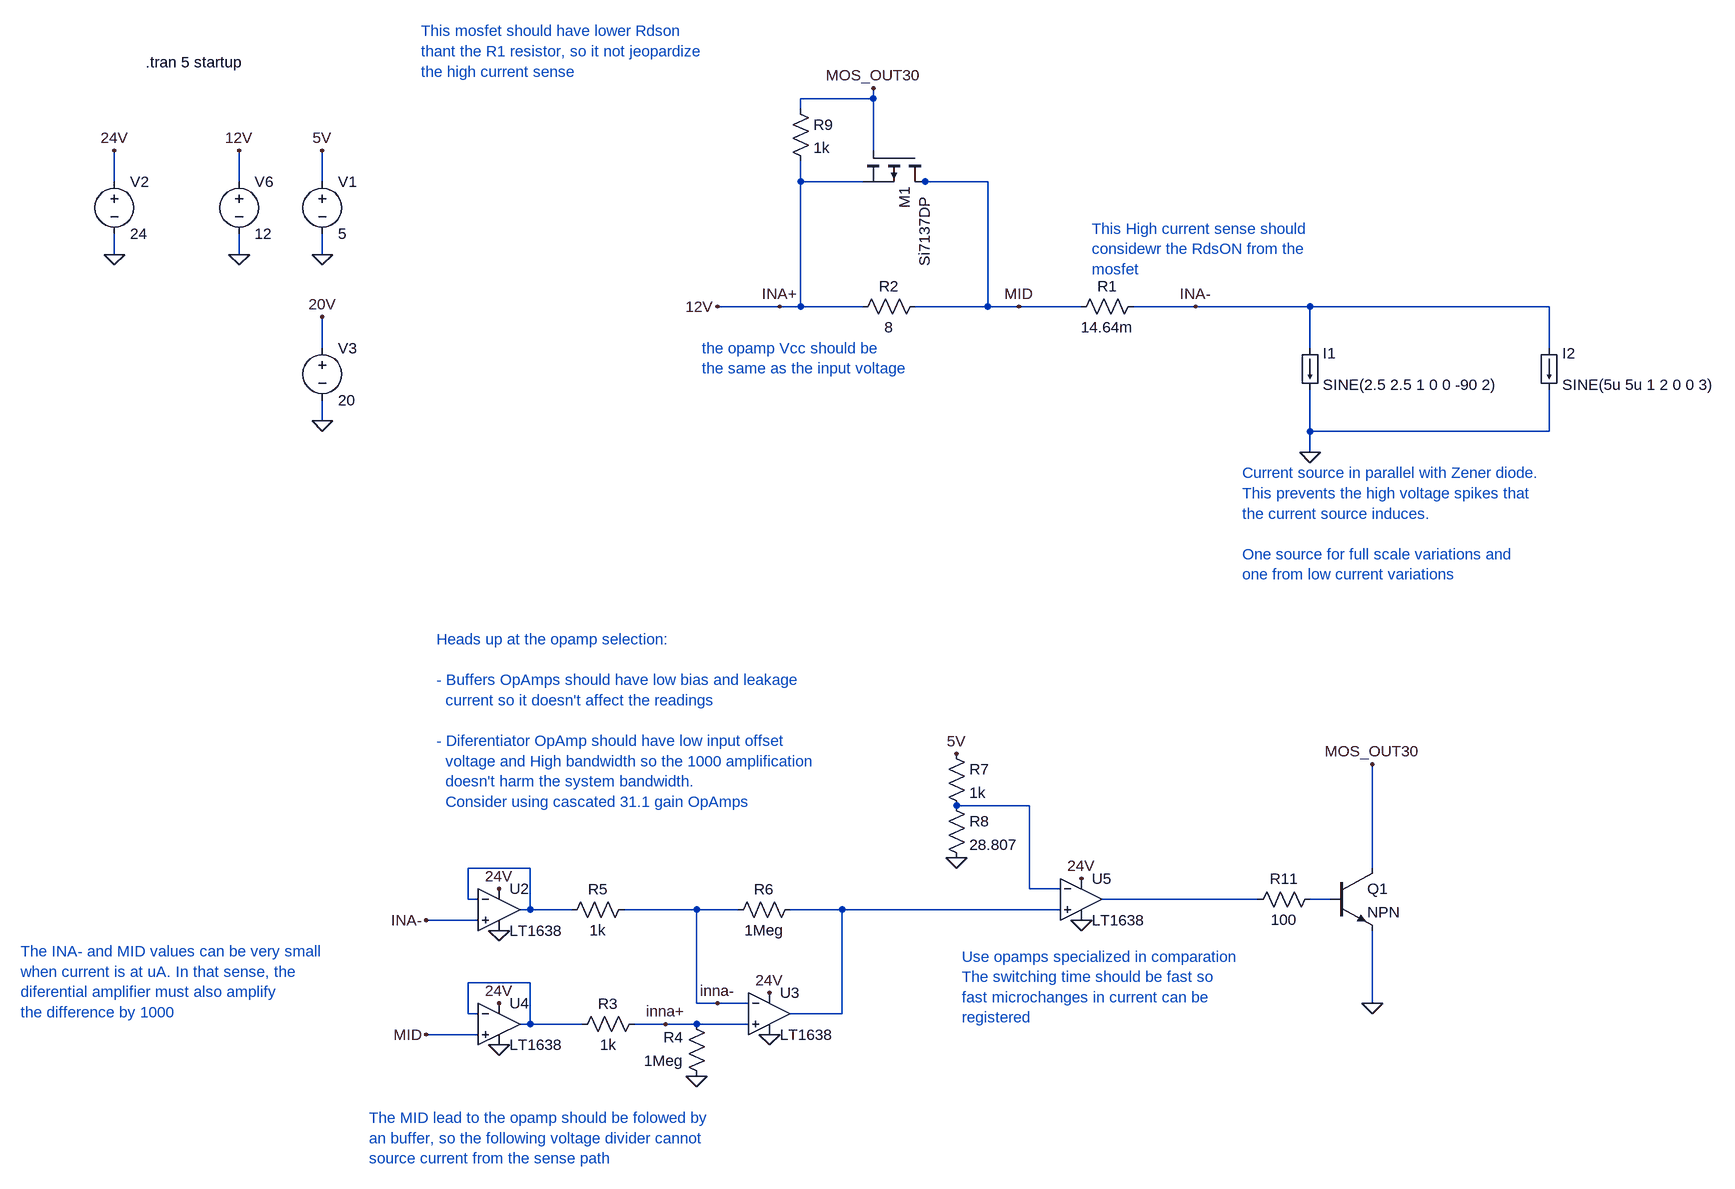
[diagram p0: schematic auto_ranging_test.asc]
auto_ranging_test.asc, the LTspice schematic file:
Version 4.1
SHEET 1 1348 1104
WIRE -112 -592 -112 -608
WIRE -112 -592 -224 -592
WIRE -224 -576 -224 -592
WIRE -112 -512 -112 -592
WIRE -1280 -464 -1280 -512
WIRE -1088 -464 -1088 -512
WIRE -960 -464 -960 -512
WIRE -224 -464 -224 -496
WIRE -128 -464 -224 -464
WIRE -32 -464 -48 -464
WIRE 64 -464 -32 -464
WIRE -1280 -352 -1280 -384
WIRE -1088 -352 -1088 -384
WIRE -960 -352 -960 -384
WIRE -256 -272 -352 -272
WIRE -224 -272 -224 -464
WIRE -224 -272 -256 -272
WIRE -128 -272 -224 -272
WIRE 64 -272 64 -464
WIRE 64 -272 -48 -272
WIRE 112 -272 64 -272
WIRE 208 -272 112 -272
WIRE 384 -272 288 -272
WIRE 560 -272 384 -272
WIRE 928 -272 560 -272
WIRE -960 -208 -960 -256
WIRE 560 -208 560 -272
WIRE 928 -208 928 -272
WIRE -960 -96 -960 -128
WIRE 560 -80 560 -144
WIRE 928 -80 928 -144
WIRE 928 -80 560 -80
WIRE 560 -48 560 -80
WIRE 128 496 16 496
WIRE -640 592 -736 592
WIRE 656 592 656 432
WIRE 128 624 128 496
WIRE 176 624 128 624
WIRE -736 640 -736 592
WIRE -720 640 -736 640
WIRE 480 640 240 640
WIRE 592 640 560 640
WIRE -640 656 -640 592
WIRE -640 656 -656 656
WIRE -576 656 -640 656
WIRE -384 656 -496 656
WIRE -320 656 -384 656
WIRE -160 656 -240 656
WIRE 176 656 -160 656
WIRE -720 672 -800 672
WIRE -640 768 -736 768
WIRE -384 800 -384 656
WIRE -352 800 -384 800
WIRE -304 800 -352 800
WIRE 656 800 656 688
WIRE -736 816 -736 768
WIRE -720 816 -736 816
WIRE -160 816 -160 656
WIRE -160 816 -240 816
WIRE -640 832 -640 768
WIRE -640 832 -656 832
WIRE -560 832 -640 832
WIRE -432 832 -480 832
WIRE -384 832 -432 832
WIRE -304 832 -384 832
WIRE -720 848 -800 848
FLAG -256 -272 INA+
FLAG 384 -272 INA-
FLAG 560 -48 0
FLAG -112 -608 MOS_OUT30
FLAG -960 -352 0
FLAG -960 -512 5V
FLAG 112 -272 MID
FLAG -1088 -352 0
FLAG -1088 -512 12V
FLAG -272 848 0
FLAG -432 832 inna+
FLAG -352 800 inna-
FLAG -800 848 MID
FLAG -800 672 INA-
FLAG -384 912 0
FLAG 16 416 5V
FLAG 16 576 0
FLAG 208 672 0
FLAG -688 688 0
FLAG -688 864 0
FLAG 656 800 0
FLAG 656 432 MOS_OUT30
FLAG -1280 -352 0
FLAG -1280 -512 24V
FLAG -960 -96 0
FLAG -960 -256 20V
FLAG -688 624 24V
FLAG -688 800 24V
FLAG -272 784 24V
FLAG -352 -272 12V
FLAG 208 608 24V
SYMBOL res 192 -256 R270
WINDOW 0 32 56 VTop 2
WINDOW 3 0 56 VBottom 2
SYMATTR InstName R1
SYMATTR Value 14.64m
SYMBOL res -144 -256 R270
WINDOW 0 32 56 VTop 2
WINDOW 3 0 56 VBottom 2
SYMATTR InstName R2
SYMATTR Value 8
SYMBOL pmos -32 -512 R90
WINDOW 3 70 1 Left 2
SYMATTR Value Si7137DP
SYMATTR InstName M1
SYMBOL voltage -960 -480 R0
WINDOW 123 0 0 Left 0
WINDOW 39 0 0 Left 0
SYMATTR InstName V1
SYMATTR Value 5
SYMBOL voltage -1088 -480 R0
WINDOW 123 0 0 Left 0
WINDOW 39 0 0 Left 0
SYMATTR InstName V6
SYMATTR Value 12
SYMBOL res -464 816 R90
WINDOW 0 0 56 VBottom 2
WINDOW 3 32 56 VTop 2
SYMATTR InstName R3
SYMATTR Value 1k
SYMBOL res -368 928 R180
WINDOW 0 36 76 Left 2
WINDOW 3 36 40 Left 2
SYMATTR InstName R4
SYMATTR Value 1Meg
SYMBOL res -480 640 R90
WINDOW 0 0 56 VBottom 2
WINDOW 3 32 56 VTop 2
SYMATTR InstName R5
SYMATTR Value 1k
SYMBOL res -224 640 R90
WINDOW 0 0 56 VBottom 2
WINDOW 3 32 56 VTop 2
SYMATTR InstName R6
SYMATTR Value 1Meg
SYMBOL res 0 400 R0
SYMATTR InstName R7
SYMATTR Value 1k
SYMBOL res 0 480 R0
SYMATTR InstName R8
SYMATTR Value 28.807
SYMBOL res 576 624 R90
WINDOW 0 0 56 VBottom 2
WINDOW 3 32 56 VTop 2
SYMATTR InstName R11
SYMATTR Value 100
SYMBOL npn 592 592 R0
SYMATTR InstName Q1
SYMBOL res -240 -592 R0
SYMATTR InstName R9
SYMATTR Value 1k
SYMBOL load 544 -208 R0
WINDOW 123 0 0 Left 0
WINDOW 39 0 0 Left 0
SYMATTR InstName I1
SYMATTR Value SINE(2.5 2.5 1 0 0 -90 2)
SYMBOL load 912 -208 R0
WINDOW 123 0 0 Left 0
WINDOW 39 0 0 Left 0
SYMATTR InstName I2
SYMATTR Value SINE(5u 5u 1 2 0 0 3)
SYMBOL OpAmps\\LT1638 -272 752 R0
SYMATTR InstName U3
SYMBOL OpAmps\\LT1638 -688 592 R0
SYMATTR InstName U2
SYMBOL OpAmps\\LT1638 -688 768 R0
SYMATTR InstName U4
SYMBOL voltage -1280 -480 R0
WINDOW 123 0 0 Left 0
WINDOW 39 0 0 Left 0
SYMATTR InstName V2
SYMATTR Value 24
SYMBOL voltage -960 -224 R0
WINDOW 123 0 0 Left 0
WINDOW 39 0 0 Left 0
SYMATTR InstName V3
SYMATTR Value 20
SYMBOL OpAmps\\LT1638 208 576 R0
SYMATTR InstName U5
TEXT -1232 -648 Left 2 !.tran 5 startup
TEXT -376 -208 Left 2 ;the opamp Vcc should be\nthe same as the input voltage
TEXT 24 728 Left 2 ;Use opamps specialized in comparation\nThe switching time should be fast so\nfast microchanges in current can be\nregistered
TEXT -808 -696 Left 2 ;This mosfet should have lower Rdson\nthant the R1 resistor, so it not jeopardize\nthe high current sense
TEXT 224 -392 Left 2 ;This High current sense should\nconsidewr the RdsON from the\nmosfet
TEXT -888 976 Left 2 ;The MID lead to the opamp should be folowed by\nan buffer, so the following voltage divider cannot\nsource current from the sense path
TEXT -1424 720 Left 2 ;The INA- and MID values can be very small\nwhen current is at uA. In that sense, the\ndiferential amplifier must also amplify\nthe difference by 1000
TEXT 456 -16 Left 2 ;Current source in parallel with Zener diode.\nThis prevents the high voltage spikes that\nthe current source induces.\n \nOne source for full scale variations and\none from low current variations
TEXT -784 240 Left 2 ;Heads up at the opamp selection:\n \n- Buffers OpAmps should have low bias and leakage\n  current so it doesn't affect the readings\n \n- Diferentiator OpAmp should have low input offset\n  voltage and High bandwidth so the 1000 amplification\n  doesn't harm the system bandwidth.\n  Consider using cascated 31.1 gain OpAmps

The netlist it stands for:
* auto_ranging_test.asc
R1 MID INA- 14.64m
R2 12V MID 8
M1 MID MOS_OUT30 12V 12V Si7137DP
V1 5V 0 5
V6 12V 0 12
R3 inna+ N006 1k
R4 0 inna+ 1Meg
R5 inna- N002 1k
R6 N005 inna- 1Meg
R7 5V N001 1k
R8 N001 0 28.807
R11 N004 N003 100
Q1 MOS_OUT30 N004 0 0 NPN
R9 MOS_OUT30 12V 1k
I1 INA- 0 SINE(2.5 2.5 1 0 0 -90 2)
I2 INA- 0 SINE(5u 5u 1 2 0 0 3)
X§U3 inna+ inna- 24V 0 N005 LT1638  ; pins In+ In- V+ V- OUT
X§U2 INA- N002 24V 0 N002 LT1638  ; pins In+ In- V+ V- OUT
X§U4 MID N006 24V 0 N006 LT1638  ; pins In+ In- V+ V- OUT
V2 24V 0 24
V3 20V 0 20
X§U5 N005 N001 24V 0 N003 LT1638  ; pins In+ In- V+ V- OUT
.model NPN NPN
.model PNP PNP
.lib standard.bjt
.model NMOS NMOS
.model PMOS PMOS
.lib standard.mos
.tran 5 startup
* the opamp Vcc should be
* the same as the input voltage
* Use opamps specialized in comparation
* The switching time should be fast so
* fast microchanges in current can be
* registered
* This mosfet should have lower Rdson
* thant the R1 resistor, so it not jeopardize
* the high current sense
* This High current sense should
* considewr the RdsON from the
* mosfet
* The MID lead to the opamp should be folowed by
* an buffer, so the following voltage divider cannot
* source current from the sense path
* The INA- and MID values can be very small
* when current is at uA. In that sense, the
* diferential amplifier must also amplify
* the difference by 1000
* Current source in parallel with Zener diode.
* This prevents the high voltage spikes that
* the current source induces.
* One source for full scale variations and
* one from low current variations
* Heads up at the opamp selection:
* - Buffers OpAmps should have low bias and leakage
*   current so it doesn't affect the readings
* - Diferentiator OpAmp should have low input offset
*   voltage and High bandwidth so the 1000 amplification
*   doesn't harm the system bandwidth.
*   Consider using cascated 31.1 gain OpAmps
.backanno
.end